# EAGLE design Root1 Starter Module (EAGLE 6.2)
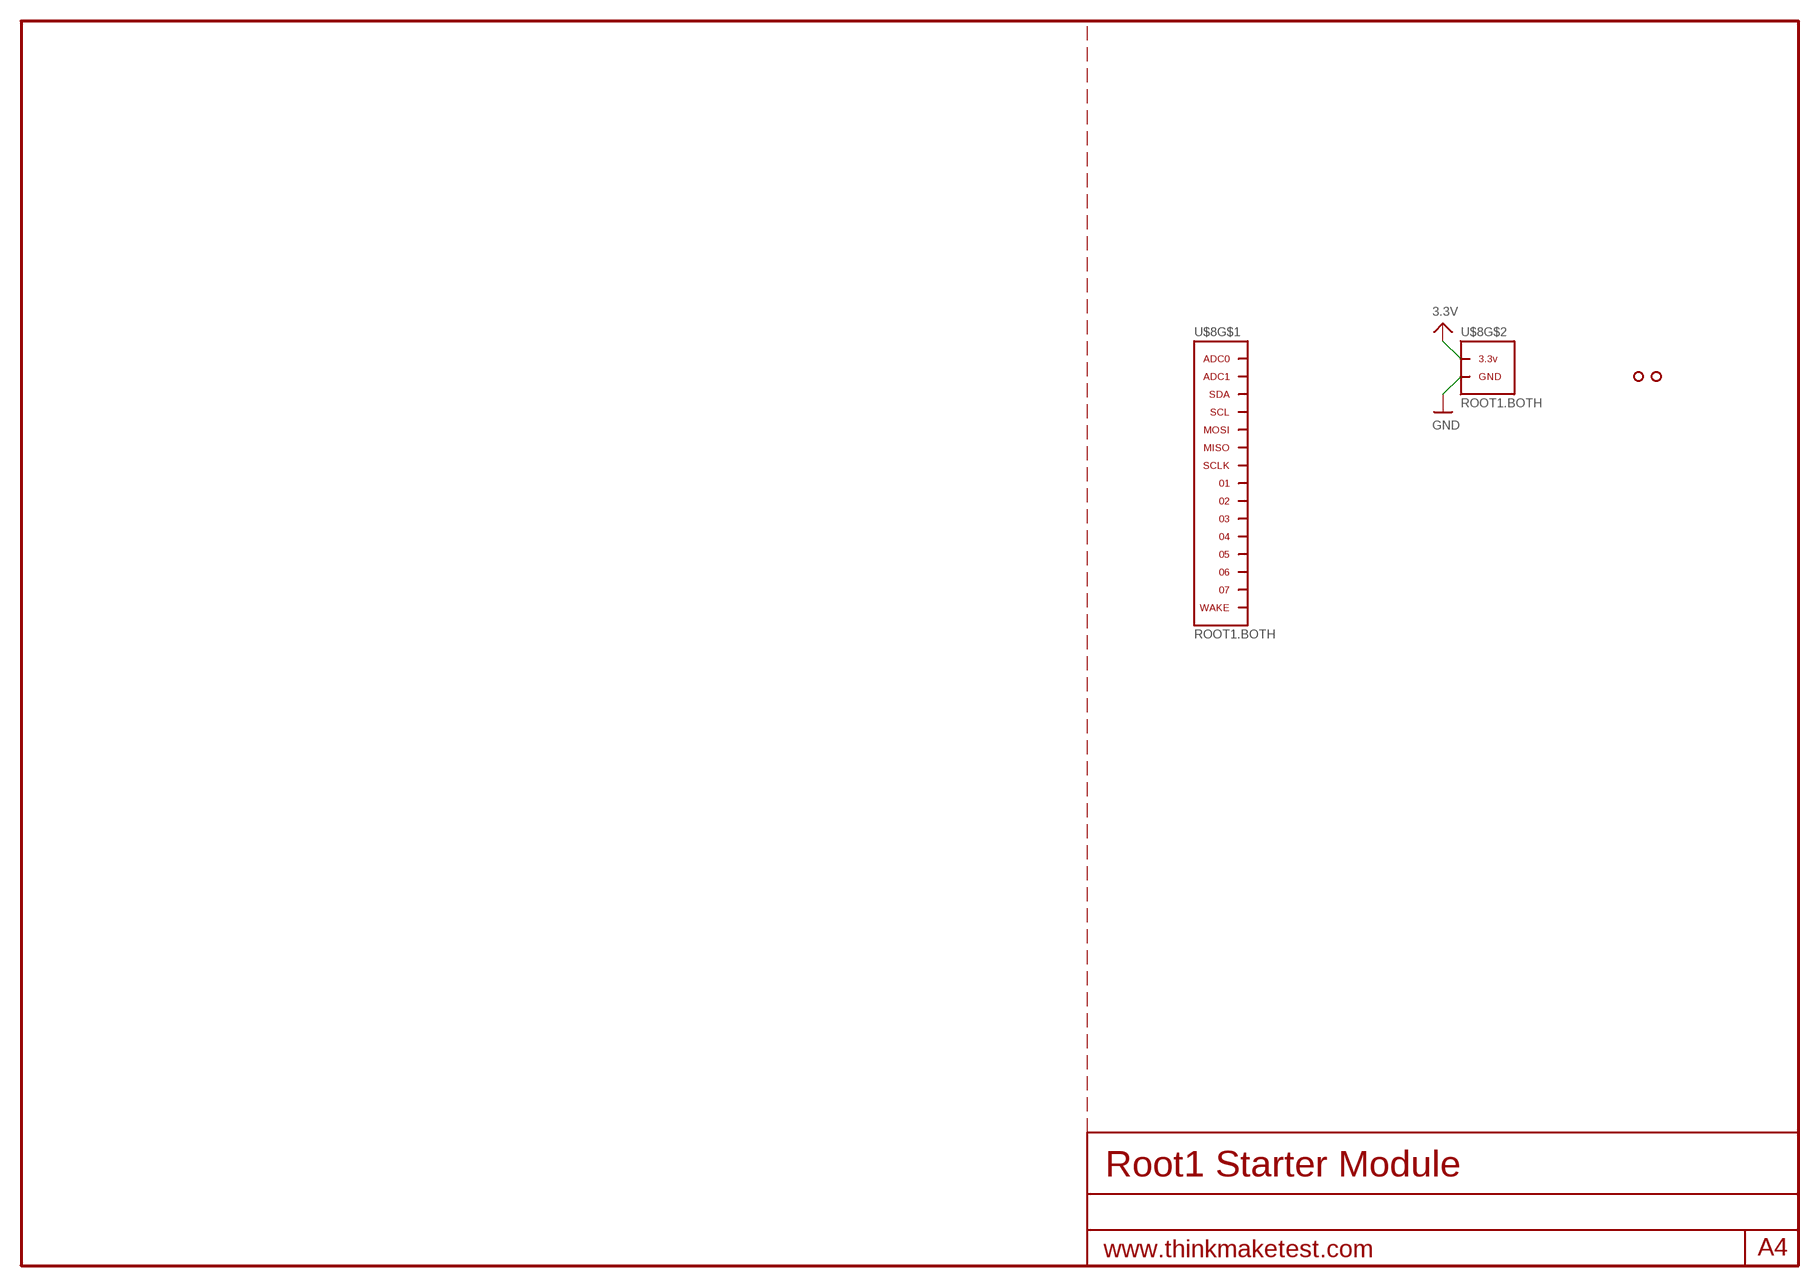
[diagram p0: schematic, sheet 1]

## Parts
U$3  HOLE.2MM  [2MM]
U$4  HOLE.2MM  [2MM]
U$8  ROOT1.BOTH  [ROOT1.BOTH]

## Nets
3.3V: U$8.3.3V@1(3.3V) U$8.3.3V@2(3.3V) U$8.3.3V@3(3.3V) U$8.3.3V@4(3.3V) U$8.3.3V@5(3.3V) U$8.3.3V@6(3.3V) U$8.3.3V@7(3.3V) U$8.3.3V@8(3.3V) U$8.3.3V@9(3.3V) U$8.3.3V@10(3.3V) U$8.3.3V@VIA(3.3V)
GND: U$8.GND@1(GND) U$8.GND@2(GND) U$8.GND@3(GND) U$8.GND@4(GND) U$8.GND@5(GND) U$8.GND@6(GND) U$8.GND@7(GND) U$8.GND@8(GND) U$8.GND@9(GND) U$8.GND@10(GND) U$8.GND@11(GND) U$8.GND@12(GND) U$8.GND@13(GND) U$8.GND@14(GND) U$8.GND@15(GND) U$8.GND@16(GND) U$8.GND@17(GND) U$8.GND@18(GND) U$8.GND@19(GND) U$8.GND@20(GND) U$8.GND@VIA(GND)
Unconnected: U$8.01 U$8.01@1 U$8.01@VIA U$8.02 U$8.02@1 U$8.02@VIA U$8.03 U$8.03@1 U$8.03@VIA U$8.04 U$8.04@1 U$8.04@VIA U$8.05 U$8.05@1 U$8.05@VIA U$8.06 U$8.06@1 U$8.06@VIA U$8.07 U$8.07@1 U$8.07@VIA U$8.ADC0 U$8.ADC0@1(ADC0) U$8.ADC0@VIA(ADC0) U$8.ADC1 U$8.ADC1@1(ADC1) U$8.ADC1@VIA(ADC1) U$8.MISO U$8.MISO@1(MISO) U$8.MISO@VIA(MISO) U$8.MOSI U$8.MOSI@1(MOSI) U$8.MOSI@VIA(MOSI) U$8.SCL U$8.SCL@1(SCL) U$8.SCL@VIA(SCL) U$8.SCLK U$8.SCLK@1(SCLK) U$8.SCLK@VIA(SCLK) U$8.SDA U$8.SDA@1(SDA) U$8.SDA@VIA(SDA) U$8.WAKE U$8.WAKE@1(WAKE) U$8.WAKE@VIA(WAKE)

## Library data of the parts
U$3 U$4 = .screw_holes:HOLE
U$8 = thinkmaketest:ROOT1

## Board
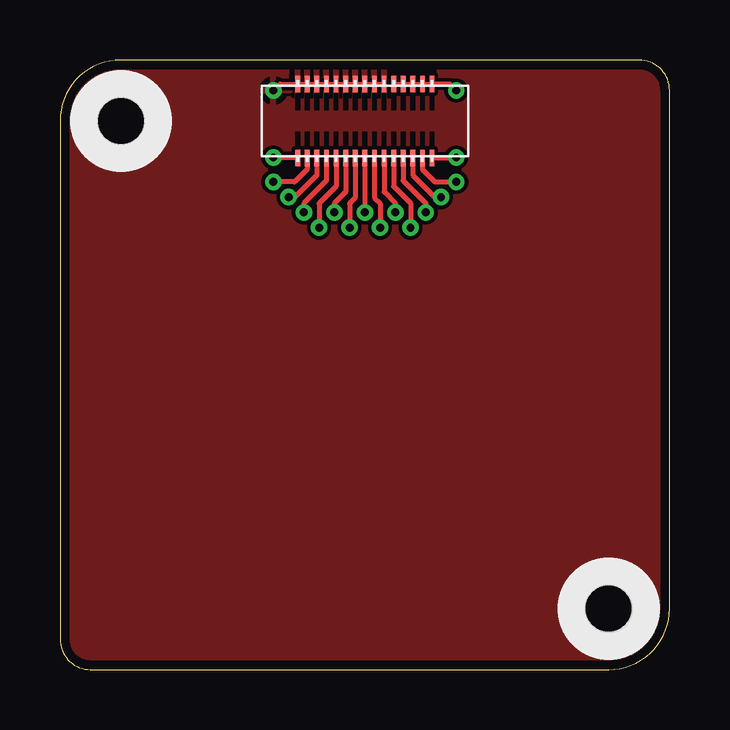
[diagram p1: board, top side]
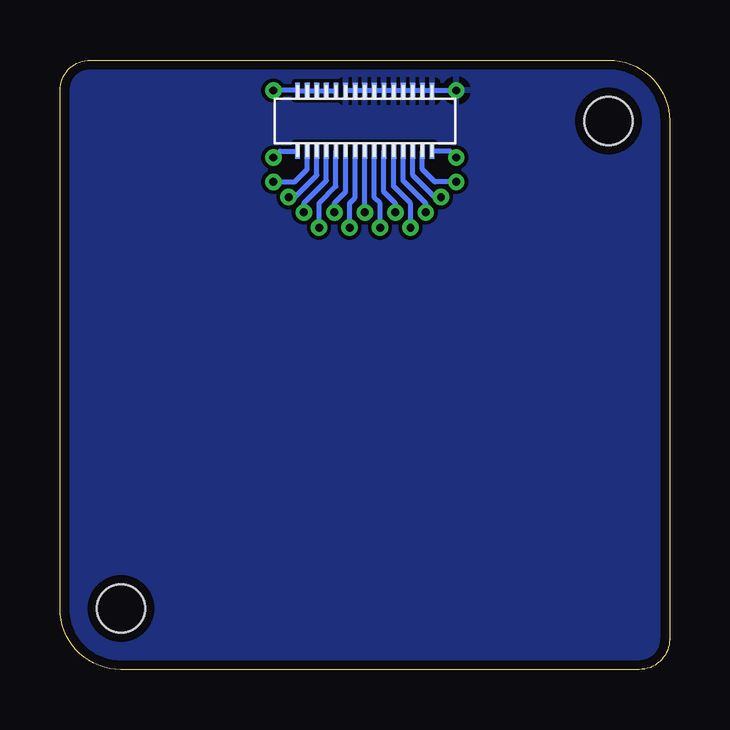
[diagram p2: board, bottom side, seen from below]

Size 25.4 x 25.4 mm. Coordinates in mm from the lower left corner, seen from the top.
Outline: 24.13,25.4 2.54,25.4 arc90 0,22.86 0,1.27 arc90 1.27,0 22.86,0 arc90 25.4,2.54 25.4,24.13 arc90 24.13,25.4
Copper layers (1*16): Top 0.0356mm / dielectric 1.5011mm / Bottom 0.0356mm
Design rules: minimum track width 6mil, minimum drill 13mil, track to track 6mil, track to pad 6mil, pad to pad 6mil, via to via 6mil, smd to smd 6mil, copper to edge 15mil, drill to drill 6mil, minimum pad ring 7mil, minimum via ring 7mil, stop-mask expansion 4mil, vias tented up to drill 16mil, thermal gap 10mil

### Footprints (pad centres in the part's own frame; a part is rotated, then mirrored left to right if it is on the bottom)
2MM = hole 2: 0,0
ROOT1.BOTH = smd 0.2 x 0.7: 01 12.7,21.32; 02 12.3,21.32; 03 11.9,21.32; 3.3V@1 15.5,24.4; 3.3V@2 15.1,24.4; 3.3V@3 14.7,24.4; 3.3V@4 14.3,24.4; 3.3V@5 13.9,24.4; 04 11.5,21.32; 05 11.1,21.32; 06 10.7,21.32; 07 10.3,21.32; ADC0 15.5,21.32; ADC1 15.1,21.32; GND@1 13.5,24.4; GND@2 13.1,24.4; GND@3 12.7,24.4; GND@4 12.3,24.4; GND@5 11.9,24.4; GND@6 11.5,24.4; GND@7 11.1,24.4; GND@8 10.7,24.4; GND@9 10.3,24.4; GND@10 9.9,24.4; MISO 13.5,21.32; MOSI 13.9,21.32; SCL 14.3,21.32; SCLK 13.1,21.32; SDA 14.7,21.32; WAKE 9.9,21.32 | smd 0.2 x 0.66 bottom: 01@1 12.7,21.605; 02@1 12.3,21.605; 3.3V@6 13.9,24.115; 3.3V@7 14.3,24.115; 3.3V@8 14.7,24.115; 3.3V@9 15.1,24.115; 3.3V@10 15.5,24.115; 03@1 11.9,21.605; 04@1 11.5,21.605; 05@1 11.1,21.605; 06@1 10.7,21.605; 07@1 10.3,21.605; ADC0@1 15.5,21.605; ADC1@1 15.1,21.605; GND@11 9.9,24.115; GND@12 10.3,24.115; GND@13 10.7,24.115; GND@14 11.1,24.115; GND@15 11.5,24.115; GND@16 11.9,24.115; GND@17 12.3,24.115; GND@18 12.7,24.115; GND@19 13.1,24.115; GND@20 13.5,24.115; MISO@1 13.5,21.605; MOSI@1 13.9,21.605; SCL@1 14.3,21.605; SCLK@1 13.1,21.605; SDA@1 14.7,21.605; WAKE@1 9.9,21.605 | drill 0.33: 01@VIA 12.7,19.05; 02@VIA 12.065,18.415; 3.3V@VIA 16.51,24.13; 03@VIA 11.43,19.05; 04@VIA 10.795,18.415; 05@VIA 10.16,19.05; 06@VIA 9.525,19.685; 07@VIA 8.89,20.32; ADC0@VIA 16.51,21.336; ADC1@VIA 16.51,20.32; GND@VIA 8.89,24.13; MISO@VIA 13.97,19.05; MOSI@VIA 14.605,18.415; SCL@VIA 15.24,19.05; SCLK@VIA 13.335,18.415; SDA@VIA 15.875,19.685; WAKE@VIA 8.89,21.336

### Placement (x,y rotation side)
U$3  22.86,2.54 0 top
U$4  2.54,22.86 0 top
U$8  0,0 0 top

### Tracks (layer width: path | path; a pad name or v marks a point on that pad's centre or on a via)
GND
  pour Bottom: 24.13,25.4 2.54,25.4 arc90 0,22.86 0,1.27 arc90 1.27,0 22.86,0 arc90 25.4,2.54 25.4,24.13 arc90
  pour Top: 24.13,25.4 2.54,25.4 arc90 0,22.86 0,1.27 arc90 1.27,0 22.86,0 arc90 25.4,2.54 25.4,24.13 arc90